# Altium schematic sheet ANALOG_INPUT.SchDoc: Analog Input
size A3; DocumentNumber: 3; SheetNumber: 3; SheetTotal: 12
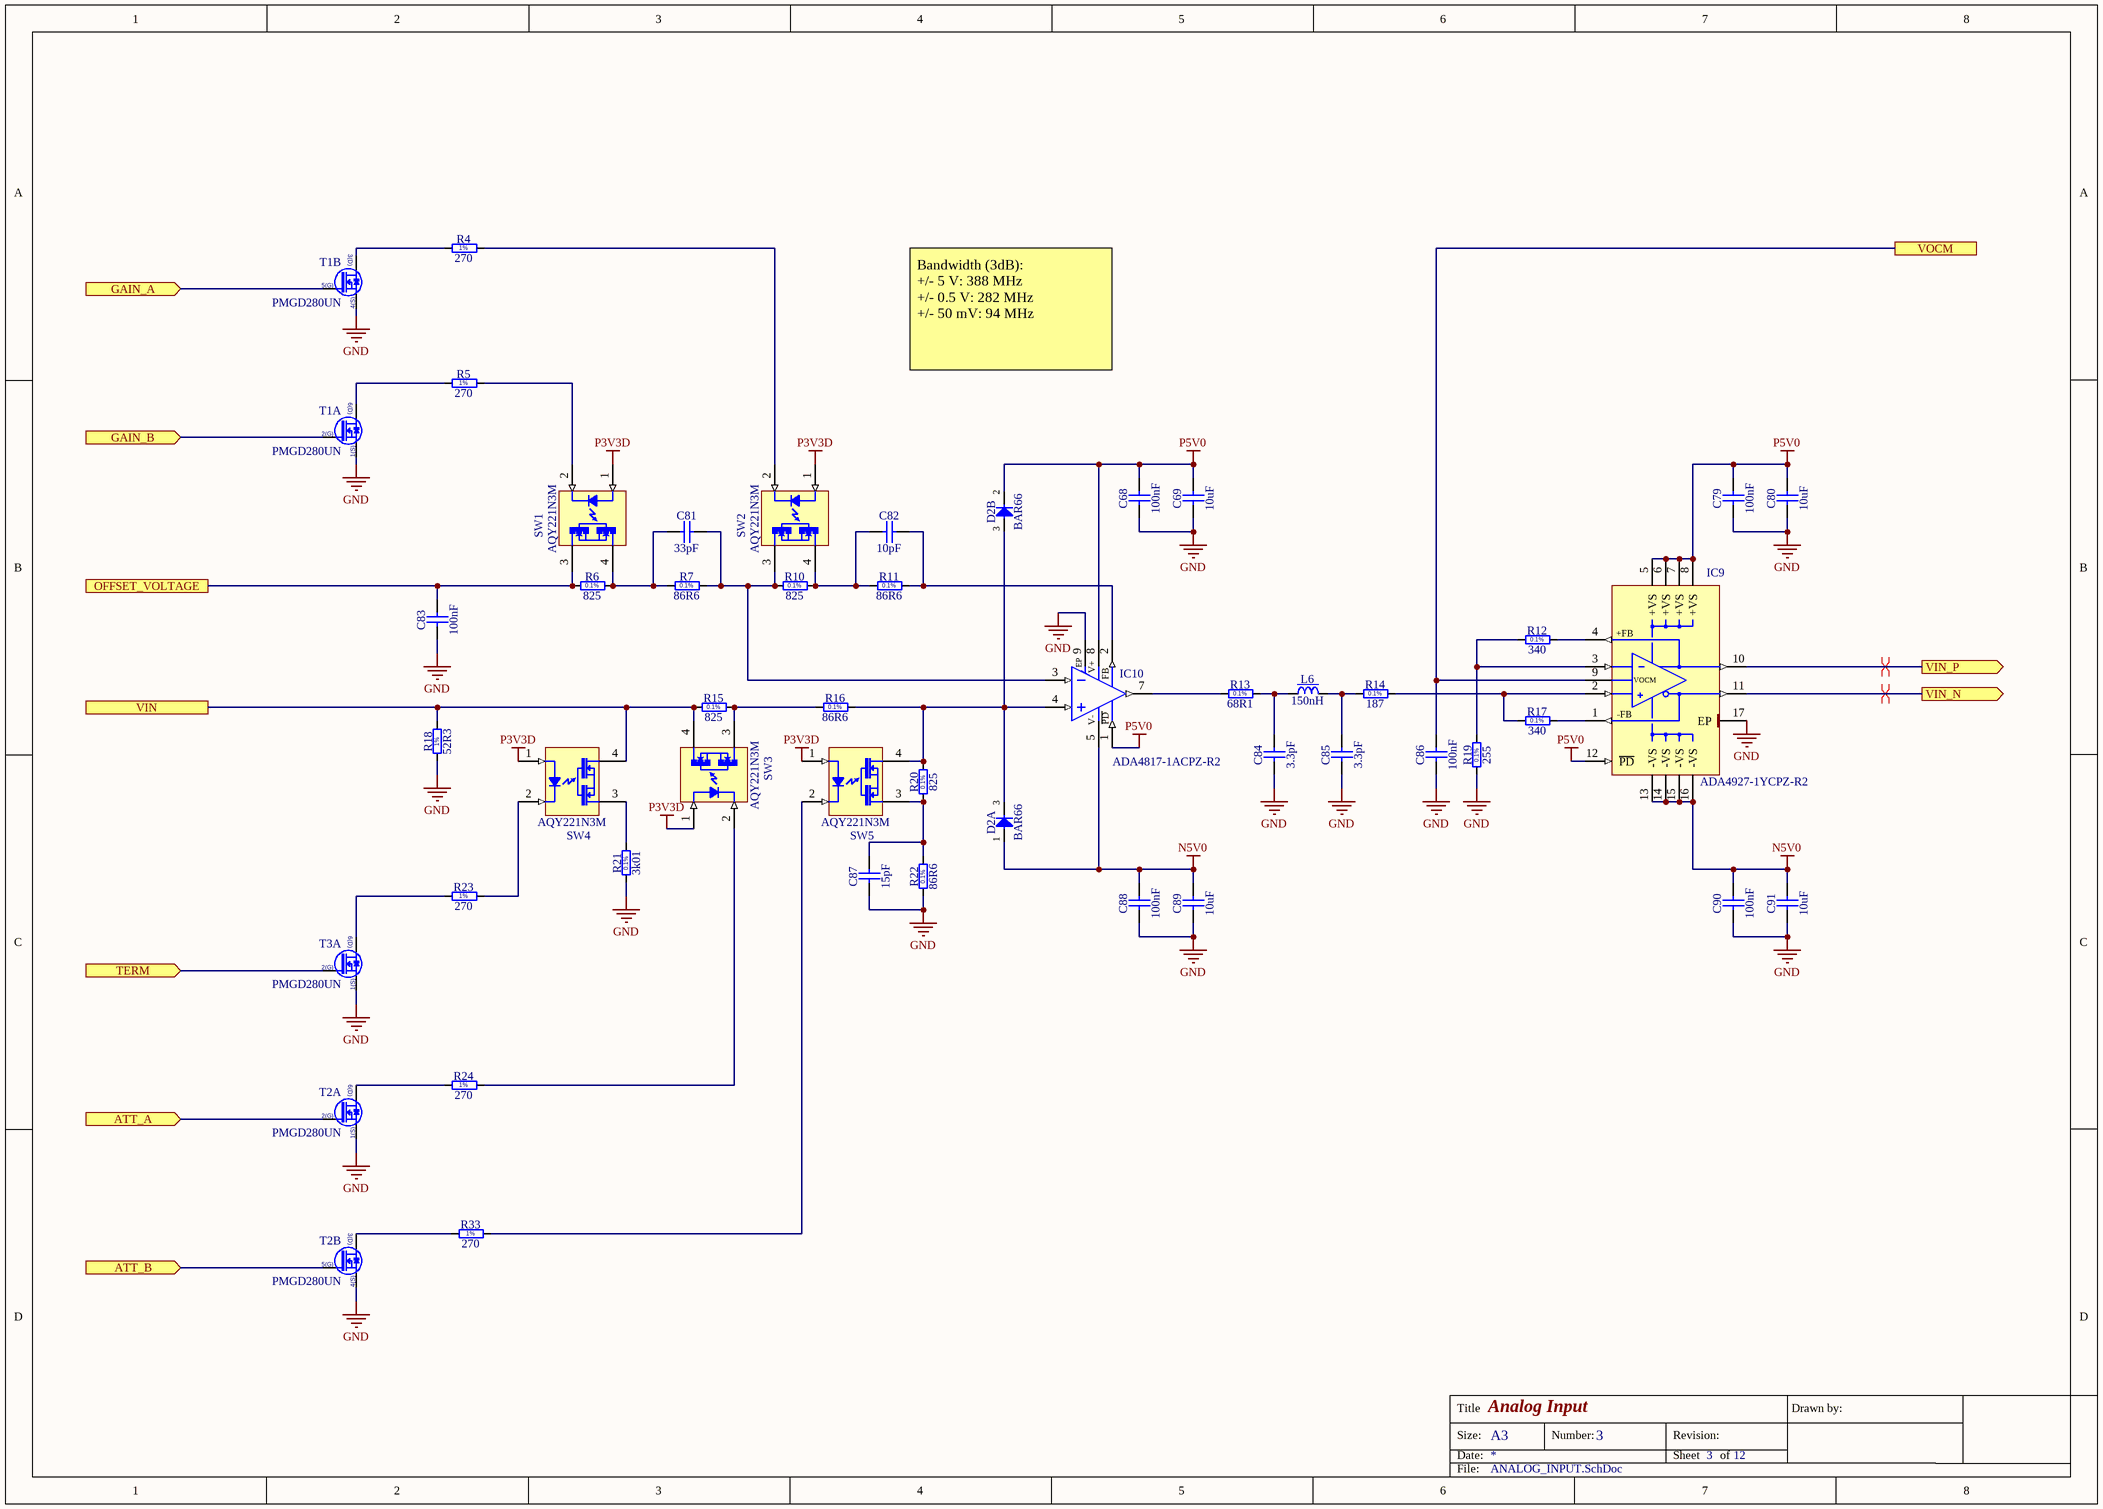
[diagram p0: ANALOG_INPUT.SchDoc]

## Parts
C68  100nF  [CAPC1005X55N]
C69  10uF  [CAPC1608X80N]
C79  100nF  [CAPC1005X55N]
C80  10uF  [CAPC1608X80N]
C81  33pF  [CAPC1608X87N]
C82  10pF  [CAPC1608X87N]
C83  100nF  [CAPC1005X55N]
C84  3.3pF  [CAPC1005X55N]
C85  3.3pF  [CAPC1005X55N]
C86  100nF  [CAPC1005X55N]
C87  15pF  [CAPC1005X55N]
C88  100nF  [CAPC1005X55N]
C89  10uF  [CAPC1608X80N]
C90  100nF  [CAPC1005X55N]
C91  10uF  [CAPC1608X80N]
D2  BAR66  [SOT95P240X110-3N]  (parts A,B of 2)
IC9  ADA4927-1YCPZ-R2  [QFN50P300X300X100-17N-S145]
IC10  ADA4817-1ACPZ-R2  [SON50P300X300X90-9N-R160X189]
L6  150nH  [IND_COILCRAFT_0805CS]
R4  270  [RESC1608X55N]
R5  270  [RESC1608X55N]
R6  825  [RESC1608X55N]
R7  86R6  [RESC1608X55N]
R10  825  [RESC1608X55N]
R11  86R6  [RESC1608X55N]
R12  340  [RESC1608X55N]
R13  68R1  [RESC1608X55N]
R14  187  [RESC1608X55N]
R15  825  [RESC1608X55N]
R16  86R6  [RESC1608X55N]
R17  340  [RESC1608X55N]
R18  52R3  [RESC6331X70N]
R19  255  [RESC1608X55N]
R20  825  [RESC1608X55N]
R21  3k01  [RESC1608X55N]
R22  86R6  [RESC1608X55N]
R23  270  [RESC1608X55N]
R24  270  [RESC1608X55N]
R33  270  [RESC1608X55N]
SW1  AQY221N3M  [PANASONIC_AQY22(SON)]
SW2  AQY221N3M  [PANASONIC_AQY22(SON)]
SW3  AQY221N3M  [PANASONIC_AQY22(SON)]
SW4  AQY221N3M  [PANASONIC_AQY22(SON)]
SW5  AQY221N3M  [PANASONIC_AQY22(SON)]
T1  PMGD280UN  [SOT65P210X110-6N]  (parts A,B of 2)
T2  PMGD280UN  [SOT65P210X110-6N]  (parts A,B of 2)
T3  PMGD280UN  [SOT65P210X110-6N]  (part A of 2)

## Ports
ATT_A (in), ATT_B (in), GAIN_A (in), GAIN_B (in), OFFSET_VOLTAGE, TERM (in), VIN, VIN_N (out), VIN_P (out), VOCM

## Nets
GND: C68.1 C69.1 C79.1 C80.1 C83.1 C84.1 C85.1 C86.1 C87.1 C88.1 C89.1 C90.1 C91.1 IC9.17(EP) IC10.9(EP) R18.1 R19.1 R21.1 R22.1 T1.1(S) T1.4(S) T2.1(S) T2.4(S) T3.1(S)
N5V0: C88.2 C89.2 C90.2 C91.2 D2.1(A) IC9.13(-VS) IC9.14(-VS) IC9.15(-VS) IC9.16(-VS) IC10.5(-Vs)
P3V3D: SW1.1(A) SW2.1(A) SW3.1(A) SW4.1(A) SW5.1(A)
P5V0: C68.2 C69.2 C79.2 C80.2 D2.2(C) IC9.5(+VS) IC9.6(+VS) IC9.7(+VS) IC9.8(+VS) IC9.12(~{PD}) IC10.1(~{PD}) IC10.8(+Vs)
ATT_A: T2.2(G) ; port ATT_A
ATT_B: T2.5(G) ; port ATT_B
GAIN_A: T1.5(G) ; port GAIN_A
GAIN_B: T1.2(G) ; port GAIN_B
OFFSET_VOLTAGE: C83.2 R6.1 SW1.3(C) ; port OFFSET_VOLTAGE
TERM: T3.2(G) ; port TERM
VIN: R15.1 R18.2 SW3.4(E) SW4.4(E) ; port VIN
VIN_N: IC9.11(-OUT) ; port VIN_N
VIN_P: IC9.10(+OUT) ; port VIN_P
VOCM: C86.2 IC9.9(VOCM) ; port VOCM
NetC81_1: C81.1 R6.2 R7.1 SW1.4(E)
NetC81_2: C81.2 IC10.3(IN-) R7.2 R10.1 SW2.3(C)
NetC82_1: C82.1 R10.2 R11.1 SW2.4(E)
NetC82_2: C82.2 IC10.2(FB) R11.2
NetC84_2: C84.2 L6.1 R13.2
NetC85_2: C85.2 L6.2 R14.1
NetC87_2: C87.2 R20.1 R22.2 SW5.3(C)
NetD2_3: D2.3(COMAC) IC10.4(IN+) R16.2 R20.2 SW5.4(E)
NetIC9_1: IC9.1(-FB) R17.2
NetIC9_2: IC9.2(+IN) R14.2 R17.1
NetIC9_3: IC9.3(-IN) R12.1 R19.2
NetIC9_4: IC9.4(+FB) R12.2
NetIC10_7: IC10.7(OUT) R13.1
NetR4_1: R4.1 T1.3(D)
NetR4_2: R4.2 SW2.2(K)
NetR5_1: R5.1 T1.6(D)
NetR5_2: R5.2 SW1.2(K)
NetR15_2: R15.2 R16.1 SW3.3(C)
NetR21_2: R21.2 SW4.3(C)
NetR23_1: R23.1 T3.6(D)
NetR23_2: R23.2 SW4.2(K)
NetR24_1: R24.1 T2.6(D)
NetR24_2: R24.2 SW3.2(K)
NetR33_1: R33.1 T2.3(D)
NetR33_2: R33.2 SW5.2(K)

## Layout directives
differential pair: VIN_N, VIN_P

## Notes on the sheet
- Bandwidth (3dB):
  +/- 5 V: 388 MHz
  +/- 0.5 V: 282 MHz
  +/- 50 mV: 94 MHz
- Title
- Size:
- Date:
- A3
- Number:
- Revision:
- Sheet
- of
- Drawn by:
- File:
- (in symbol ADA4817-1ACPZ-R2) V+; PD; V-
- (in symbol PMGD280UN, part A) 6(D); 2(G); 1(S)
- (in symbol PMGD280UN, part B) 3(D); 5(G); 4(S)
- (in symbol R0603_3K01_0.1%_0.063W_10PPM) 0.1%
- (in symbol R0603_68R1_0.1%_0.063W_10PPM) 0.1%
- (in symbol R0603_86R6_0.1%_0.1W_15PPM) 0.1%
- (in symbol R0603_187R_0.1%_0.063W_10PPM) 0.1%
- (in symbol R0603_255R_0.1%_0.063W_10PPM) 0.1%
- (in symbol R0603_270R_1%_0.1W_100PPM) 1%
- (in symbol R0603_340R_0.1%_0.063W_10PPM) 0.1%
- (in symbol R0603_825R_0.1%_0.063W_10PPM) 0.1%
- (in symbol R2512_52R3_1%_1W_100PPM) 1%

## Library data of the parts
C68 C79 C83 C86 C88 C90 = CC0402_100NF_16V_10%_X7R: Non-polarised capacitor; Part Description: SMD Multilayer Chip Ceramic Capacitor; Manufacturer: GENERIC; Manufacturer1 Part Number: GRM155R71C104KA88D; Voltage: 16V; TC: X7R; Tolerance: ±10%; Part Number: CC0402_100NF_16V_10%_X7R; Component Kind: Standard; Component Type: Standard; Pin Count: 2; Value: 100nF; Status: Not Recommended; Manufacturer Part Number: CC0402_100NF_16V_10%_X7R; Case: 0402; Mounted: Yes; Socket: No; SMD: Yes; Sense: No; Manufacturer1 Example: MURATA; Manufacturer1 ComponentHeight: 0.55mm; HelpURL: \\cern.ch\dfs\Applications\Altium\Datasheets\CC0402_X7R_MURATA_GRM.pdf; Author: CERN DEM JLC; CreateDate: 05.12.2013; LatestRevisionDate: 03.12.2007
C69 C80 C89 C91 = CC0603_10UF_16V_20%_X5R: Non-polarised capacitor; Part Description: SMD Multilayer Chip Ceramic Capacitor; Manufacturer: GENERIC; Manufacturer1 Part Number: GRM188R61C106MA73D; Voltage: 16V; TC: X5R; Tolerance: ±20%; Part Number: CC0603_10UF_16V_20%_X5R; Component Kind: Standard; Component Type: Standard; Pin Count: 2; Value: 10uF; Status: None; Manufacturer Part Number: CC0603_10UF_16V_20%_X5R; Case: 0603; Mounted: Yes; Socket: No; SMD: Yes; Sense: No; Manufacturer1 Example: MURATA; Manufacturer1 ComponentHeight: 0.8mm; HelpURL: \\cern.ch\dfs\Applications\Altium\Datasheets\CC0603_X5R_MURATA_GRM.pdf; Author: CERN DEM MR; CreateDate: 02.03.2016; LatestRevisionDate: 02.03.2016
C81 = CC0603_33PF_50V_5%_NP0: Non-polarised capacitor; Part Description: SMD Multilayer Chip Ceramic Capacitor; Manufacturer: GENERIC; Manufacturer1 Part Number: 223886715339; Voltage: 50V; TC: C0G/NP0; Tolerance: ±5%; Part Number: CC0603_33PF_50V_5%_NP0; Component Kind: Standard; Component Type: Standard; Pin Count: 2; Value: 33pF; Status: Preferred; Manufacturer Part Number: CC0603_33PF_50V_5%_NP0; Case: 0603; Mounted: Yes; Socket: No; SMD: Yes; Sense: No; Manufacturer1 Example: PHYCOMP; Manufacturer1 ComponentHeight: 0.87mm; HelpURL: \\cern.ch\dfs\Applications\Altium\Datasheets\CC0603_NP0_PHYCOMP.pdf; Author: CERN DEM JLC; CreateDate: 03.12.2007; LatestRevisionDate: 03.12.2007
C82 = CC0603_10PF_50V_5%_NP0: Non-polarised capacitor; Part Description: SMD Multilayer Chip Ceramic Capacitor; Manufacturer: GENERIC; Manufacturer1 Part Number: 223886715109; Voltage: 50V; TC: C0G/NP0; Tolerance: ±5%; Part Number: CC0603_10PF_50V_5%_NP0; Component Kind: Standard; Component Type: Standard; Pin Count: 2; Value: 10pF; Status: Preferred; Manufacturer Part Number: CC0603_10PF_50V_5%_NP0; Case: 0603; Mounted: Yes; Socket: No; SMD: Yes; Sense: No; Manufacturer1 Example: PHYCOMP; Manufacturer1 ComponentHeight: 0.87mm; HelpURL: \\cern.ch\dfs\Applications\Altium\Datasheets\CC0603_NP0_PHYCOMP.pdf; Author: CERN DEM JLC; CreateDate: 03.12.2007; LatestRevisionDate: 03.12.2007
C84 C85 = CC0402_3.3PF_50V_0.25PF_C0G: Non-polarised capacitor; Part Description: SMD Multilayer Chip Ceramic Capacitor; Manufacturer: GENERIC; Manufacturer1 Part Number: C0402C339C5GACTU; Voltage: 50V; TC: C0G/NP0; Tolerance: ±0.25pF; Part Number: CC0402_3.3PF_50V_0.25PF_C0G; Component Kind: Standard; Component Type: Standard; Pin Count: 2; Value: 3.3pF; Status: Preferred; Manufacturer Part Number: CC0402_3.3PF_50V_0.25PF_C0G; Case: 0402; Mounted: Yes; Socket: No; SMD: Yes; Sense: No; Manufacturer1 Example: KEMET; Manufacturer1 ComponentHeight: 0.55mm; HelpURL: \\cern.ch\dfs\Applications\Altium\Datasheets\CC0805_C0G_KEMET_(Commercial Grade).pdf; Author: CERN DEM JLC; CreateDate: 03.12.2007; LatestRevisionDate: 22.04.2015
C87 = CC0402_15PF_50V_5%_C0G: Non-polarised capacitor; Part Description: SMD Multilayer Chip Ceramic Capacitor; Manufacturer: GENERIC; Manufacturer1 Part Number: C0402C150J5GACTU; Voltage: 50V; TC: C0G/NP0; Tolerance: ±5%; Part Number: CC0402_15PF_50V_5%_C0G; Component Kind: Standard; Component Type: Standard; Pin Count: 2; Value: 15pF; Status: Preferred; Manufacturer Part Number: CC0402_15PF_50V_5%_C0G; Case: 0402; Mounted: Yes; Socket: No; SMD: Yes; Sense: No; Manufacturer1 Example: KEMET; Manufacturer1 ComponentHeight: 0.55mm; HelpURL: \\cern.ch\dfs\Applications\Altium\Datasheets\CC0805_C0G_KEMET_(Commercial Grade).pdf; Author: CERN DEM JLC; CreateDate: 03.12.2007; LatestRevisionDate: 22.04.2015
D2 = BAR66: Serial Diode; Part Description: Silicon PIN Diode Array (Series Connected); Manufacturer: INFINEON; Voltage: 150V; Power: 250mA; PressFit: No; Bonding: No; Part Number: BAR66; Component Kind: Standard; Component Type: Standard; Device: BAR66; PackageDescription: SOT23 3-Leads, Pitch 0.95mm - Body 1.3x2.9mm, IPC Medium Density; Manufacturer Part Number: BAR66; Pin Count: 3; Case: SOT23; Mounted: Yes; Socket: No; SMD: Yes; Sense: No; ComponentHeight: 1.1mm; HelpURL: \\cern.ch\dfs\Applications\Altium\Datasheets\BAR66.pdf; Author: CERN DEM JLC; CreateDate: 18.01.2010; LatestRevisionDate: 05.10.2010
IC9 = ADA4927-1YCPZ-R2: Ultralow Distortion Current Feedback Differential ADC Driver; Manufacturer: ANALOG DEVICES; PressFit: No; Bonding: No; Part Number: ADA4927-1YCPZ-R2; Component Kind: Standard; Component Type: Standard; Device: ADA4927-1YCPZ-R2; PackageDescription: QFN,0.50mm pitch,square; 4 pin X 4 pin, 3mm X 3mm X 1.00mm H body (w/thermal tab 1.45 X 1.45mm),  IPC Medium Density; Part Description: Ultralow Distortion Current Feedback Differential ADC Driver; Manufacturer Part Number: ADA4927-1YCPZ-R2; Pin Count: 17; Case: QFN16; Mounted: Yes; Socket: No; SMD: Yes; Sense: No; ComponentHeight: 1mm; Author: CERN DEM JLC; HelpURL: \\cern.ch\dfs\Applications\Altium\Datasheets\ADA4927-1YCPZ-R2.pdf; CreateDate: 19.04.2010; LatestRevisionDate: 19.04.2010
IC10 = ADA4817-1ACPZ-R2: Low Noise, 1GHz FastFEET Operational Amplifier; Manufacturer: ANALOG DEVICES; PressFit: No; Bonding: No; Part Number: ADA4817-1ACPZ-R2; Component Kind: Standard; Component Type: Standard; Device: ADA4817-1ACPZ-R2; PackageDescription: SON (DFN), 0.50mm pitch, 8 pin, 3mm X 3mm X 0.9mm H body (w/thermal tab 1.6 X 1.89mm),  IPC Medium Density; Part Description: Low Noise, 1GHz FastFEET Operational Amplifier; Manufacturer Part Number: ADA4817-1ACPZ-R2; Pin Count: 8; Case: SON8; Mounted: Yes; Socket: No; SMD: Yes; Sense: No; ComponentHeight: 0.9mm; Author: CERN DEM JLC; HelpURL: \\cern.ch\dfs\Applications\Altium\Datasheets\ADA4817-1ACPZ-R2.pdf; CreateDate: 01.07.2014; LatestRevisionDate: 01.07.2014
L6 = IND_150NH_2%_COILCRAFT_0805CS: Inductor With Core; Part Description: SMT Chip Inductor; Manufacturer Part Number: 0805CS-151XGLC; Power: 400mA; Resistance: 0.56R; Tolerance: ±2%; Part Number: IND_150NH_2%_COILCRAFT_0805CS; Component Kind: Standard; Component Type: Standard; Pin Count: 2; Value: 150nH; Status: None; Manufacturer: COILCRAFT; Case: 0805; Mounted: Yes; Socket: No; SMD: Yes; Sense: No; ComponentHeight: 1.52mm; HelpURL: \\cern.ch\dfs\Applications\Altium\Datasheets\IND_COILCRAFT_0805CS.pdf; Author: CERN DEM JLC; CreateDate: 03.03.2015; LatestRevisionDate: 03.03.2015
R4 R5 R23 R24 R33 = R0603_270R_1%_0.1W_100PPM: Resistor - 1%; Part Description: General Purpose Thick Film Chip Resistor; Manufacturer: GENERIC; Manufacturer1 Part Number: NRC06F2700TRF; Power: 0.1W; TC: ±100ppm/°C; Part Number: R0603_270R_1%_0.1W_100PPM; Component Kind: Standard; Component Type: Standard; Pin Count: 2; Value: 270; Status: Preferred; Tolerance: ±1%; Manufacturer Part Number: R0603_270R_1%_0.1W_100PPM; Case: 0603; Mounted: Yes; Sense: No; Socket: No; SMD: Yes; Manufacturer1 Example: NIC COMPONENT; Manufacturer1 ComponentHeight: 0.55mm; HelpURL: \\cern.ch\dfs\Applications\Altium\Datasheets\R0603_NIC_NRC.pdf; Author: CERN DEM JLC; CreateDate: 03.12.2007; LatestRevisionDate: 13.03.2008
R6 R10 R15 R20 = R0603_825R_0.1%_0.063W_10PPM: Resistor - 0.1%; Part Description: Thin Film Chip Resistor; Manufacturer: GENERIC; Manufacturer1 Part Number: RN73C1J825RBTDF; Power: 0.063W; TC: ±10ppm; Part Number: R0603_825R_0.1%_0.063W_10PPM; Component Kind: Standard; Component Type: Standard; Pin Count: 2; Value: 825; Status: Not recommended; Tolerance: ±0.1%; Manufacturer Part Number: R0603_825R_0.1%_0.063W_10PPM; Case: 0603; Mounted: Yes; Sense: No; Socket: No; SMD: Yes; Manufacturer1 Example: TYCO HOLSWORTHY; Manufacturer1 ComponentHeight: 0.5mm; HelpURL: \\cern.ch\dfs\Applications\Altium\Datasheets\R0603_Tyco_RN73.pdf; Author: CERN DEM JLC; CreateDate: 03.12.2007; LatestRevisionDate: 13.03.2008
R7 R11 R16 R22 = R0603_86R6_0.1%_0.1W_15PPM: Resistor - 0.1%; Part Description: Thin Film Chip Resistor; Manufacturer: GENERIC; Manufacturer1 Part Number: RP73D1J86R6BTDG; Power: 0.1W; TC: ±15ppm; Part Number: R0603_86R6_0.1%_0.1W_15PPM; Component Kind: Standard; Component Type: Standard; Pin Count: 2; Value: 86R6; Status: Not recommended; Tolerance: ±0.1%; Manufacturer Part Number: R0603_86R6_0.1%_0.1W_15PPM; Case: 0603; Mounted: Yes; Sense: No; Socket: No; SMD: Yes; Manufacturer1 Example: TYCO HOLSWORTHY; Manufacturer1 ComponentHeight: 0.5mm; HelpURL: \\cern.ch\dfs\Applications\Altium\Datasheets\R0603_TYCO_RP73.pdf; Author: CERN DEM JLC; CreateDate: 26.01.2010; LatestRevisionDate: 26.01.2010
R12 R17 = R0603_340R_0.1%_0.063W_10PPM: Resistor - 0.1%; Part Description: Thin Film Chip Resistor; Manufacturer: GENERIC; Manufacturer1 Part Number: RN73C1J340RBTDF; Power: 0.063W; TC: ±10ppm; Part Number: R0603_340R_0.1%_0.063W_10PPM; Component Kind: Standard; Component Type: Standard; Pin Count: 2; Value: 340; Status: Not recommended; Tolerance: ±0.1%; Manufacturer Part Number: R0603_340R_0.1%_0.063W_10PPM; Case: 0603; Mounted: Yes; Sense: No; Socket: No; SMD: Yes; Manufacturer1 Example: TYCO HOLSWORTHY; Manufacturer1 ComponentHeight: 0.5mm; HelpURL: \\cern.ch\dfs\Applications\Altium\Datasheets\R0603_Tyco_RN73.pdf; Author: CERN DEM JLC; CreateDate: 03.12.2007; LatestRevisionDate: 13.03.2008
R13 = R0603_68R1_0.1%_0.063W_10PPM: Resistor - 0.1%; Part Description: Thin Film Chip Resistor; Manufacturer: GENERIC; Manufacturer1 Part Number: RN73C1J68R1BTDF; Power: 0.063W; TC: ±10ppm; Part Number: R0603_68R1_0.1%_0.063W_10PPM; Component Kind: Standard; Component Type: Standard; Pin Count: 2; Value: 68R1; Status: Not recommended; Tolerance: ±0.1%; Manufacturer Part Number: R0603_68R1_0.1%_0.063W_10PPM; Case: 0603; Mounted: Yes; Sense: No; Socket: No; SMD: Yes; Manufacturer1 Example: TYCO HOLSWORTHY; Manufacturer1 ComponentHeight: 0.5mm; HelpURL: \\cern.ch\dfs\Applications\Altium\Datasheets\R0603_Tyco_RN73.pdf; Author: CERN DEM JLC; CreateDate: 03.12.2007; LatestRevisionDate: 13.03.2008
R14 = R0603_187R_0.1%_0.063W_10PPM: Resistor - 0.1%; Part Description: Thin Film Chip Resistor; Manufacturer: GENERIC; Manufacturer1 Part Number: RN73C1J187RBTDF; Power: 0.063W; TC: ±10ppm; Part Number: R0603_187R_0.1%_0.063W_10PPM; Component Kind: Standard; Component Type: Standard; Pin Count: 2; Value: 187; Status: Not recommended; Tolerance: ±0.1%; Manufacturer Part Number: R0603_187R_0.1%_0.063W_10PPM; Case: 0603; Mounted: Yes; Sense: No; Socket: No; SMD: Yes; Manufacturer1 Example: TYCO HOLSWORTHY; Manufacturer1 ComponentHeight: 0.5mm; HelpURL: \\cern.ch\dfs\Applications\Altium\Datasheets\R0603_Tyco_RN73.pdf; Author: CERN DEM JLC; CreateDate: 03.12.2007; LatestRevisionDate: 13.03.2008
R18 = R2512_52R3_1%_1W_100PPM: Resistor - 1%; Part Description: Thick Film Chip Resistor; Manufacturer: GENERIC; Manufacturer1 Part Number: ERJ-1TNF52R3U; Power: 1W; TC: ±100ppm/°C; Part Number: R2512_52R3_1%_1W_100PPM; Component Kind: Standard; Component Type: Standard; Pin Count: 2; Value: 52R3; Status: Preferred; Tolerance: ±1%; Manufacturer Part Number: R2512_52R3_1%_1W_100PPM; Case: 2512; Mounted: Yes; Sense: No; Socket: No; SMD: Yes; Manufacturer1 Example: Panasonic; Manufacturer1 ComponentHeight: 0.65mm; Author: *
R19 = R0603_255R_0.1%_0.063W_10PPM: Resistor - 0.1%; Part Description: Thin Film Chip Resistor; Manufacturer: GENERIC; Manufacturer1 Part Number: RN73C1J255RBTDF; Power: 0.063W; TC: ±10ppm; Part Number: R0603_255R_0.1%_0.063W_10PPM; Component Kind: Standard; Component Type: Standard; Pin Count: 2; Value: 255; Status: Not recommended; Tolerance: ±0.1%; Manufacturer Part Number: R0603_255R_0.1%_0.063W_10PPM; Case: 0603; Mounted: Yes; Sense: No; Socket: No; SMD: Yes; Manufacturer1 Example: TYCO HOLSWORTHY; Manufacturer1 ComponentHeight: 0.5mm; HelpURL: \\cern.ch\dfs\Applications\Altium\Datasheets\R0603_Tyco_RN73.pdf; Author: CERN DEM JLC; CreateDate: 03.12.2007; LatestRevisionDate: 13.03.2008
R21 = R0603_3K01_0.1%_0.063W_10PPM: Resistor - 0.1%; Part Description: Thin Film Chip Resistor; Manufacturer: GENERIC; Manufacturer1 Part Number: RN73C1J3K01BTDF; Power: 0.063W; TC: ±10ppm; Part Number: R0603_3K01_0.1%_0.063W_10PPM; Component Kind: Standard; Component Type: Standard; Pin Count: 2; Value: 3k01; Status: Not recommended; Tolerance: ±0.1%; Manufacturer Part Number: R0603_3K01_0.1%_0.063W_10PPM; Case: 0603; Mounted: Yes; Sense: No; Socket: No; SMD: Yes; Manufacturer1 Example: TYCO HOLSWORTHY; Manufacturer1 ComponentHeight: 0.5mm; HelpURL: \\cern.ch\dfs\Applications\Altium\Datasheets\R0603_Tyco_RN73.pdf; Author: CERN DEM JLC; CreateDate: 03.12.2007; LatestRevisionDate: 13.03.2008
SW1-SW5 = AQY221N3M: PhotoMOS Relay; Part Description: Micro-miniature SON Package Lower Output Capacitance and On Resistance (C×R5) 25V Load Voltage PhotoMOS Relay; Manufacturer: PANASONIC ELECTRIC WORKS; Table: Optocouplers; Part Number: AQY221N3M; Component Kind: Standard; Component Type: Standard; Device: AQY221N3M; PackageDescription: PANASONIC Serie AQY22(SON)  Small Outline No Lead, 4 pins, 2.2x2.95mm; Manufacturer Part Number: AQY221N3M; Pin Count: 4; Case: SON4; Mounted: Yes; Socket: No; SMD: Yes; ComponentHeight: 1.4mm; HelpURL: \\cern.ch\dfs\Applications\Altium\Datasheets\AQY221N3M.pdf; ComponentLink1Description: Package Drawing; ComponentLink1URL: \\cern.ch\dfs\Applications\Altium\Datasheets\AQY221N3M_Package-Drawing.pdf; Author: CERN DEM JLC; CreateDate: 18/01/2010; LatestRevisionDate: 18/01/2010
T1-T3 = PMGD280UN: Dual N-Channel micro TrenchMOS™ Ultra Low Level FET; Part Description: 20V 870mA Dual N-Channel micro TrenchMOS™ Ultra Low Level FET; Manufacturer: NXP SEMICONDUCTORS; PressFit: No; Bonding: No; Part Number: PMGD280UN; Component Kind: Standard; Component Type: Standard; Device: PMGD280UN; PackageDescription: SOT363, SC70-6, SOT, 0.65mm Pitch, 6 pin, 1.25mm W X 2.00mm L X 1.10mm H, IPC Medium Density; Manufacturer Part Number: PMGD280UN; Pin Count: 6; Case: SOT363; Mounted: Yes; Socket: No; SMD: Yes; Sense: No; ComponentHeight: 1.1mm; HelpURL: \\cern.ch\dfs\Applications\Altium\Datasheets\PMGD280UN.pdf; Author: CERN DEM JLC; CreateDate: 19.11.2014; LatestRevisionDate: 19.11.2014